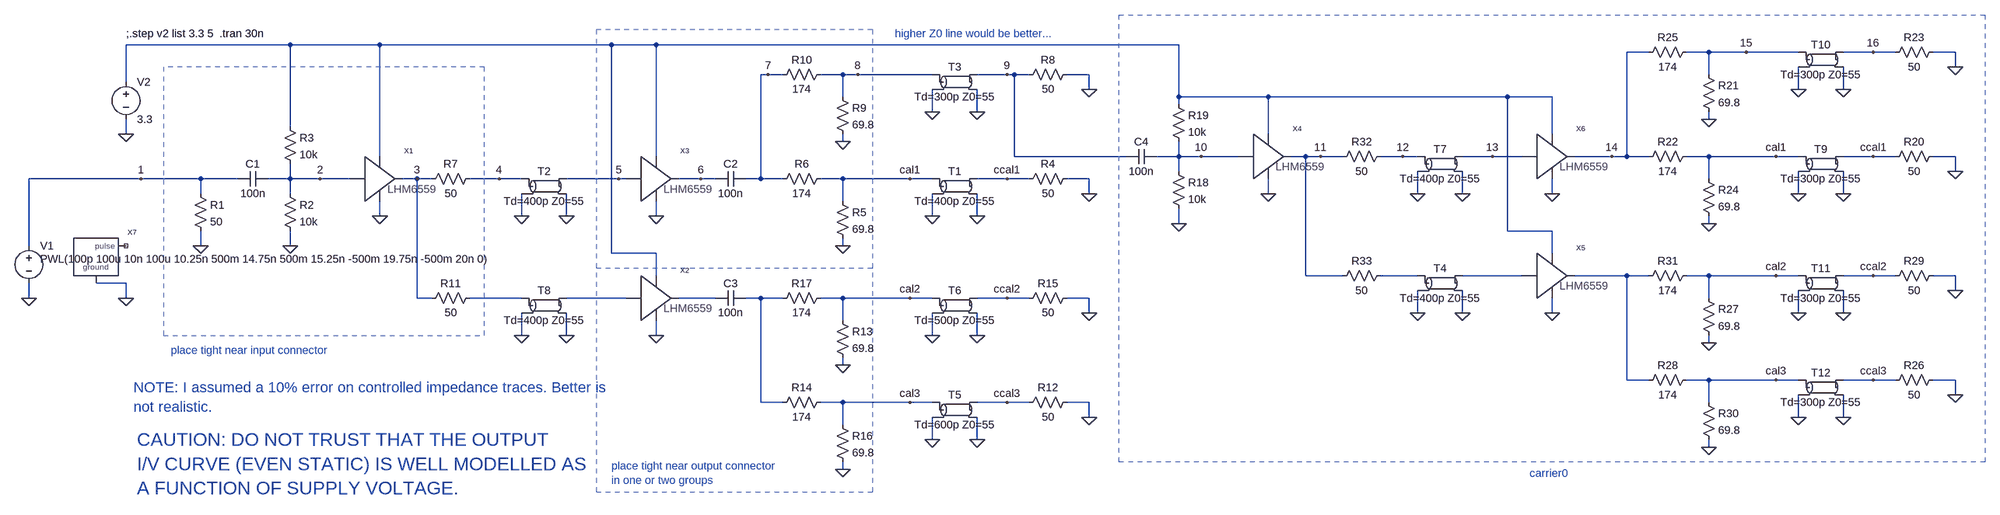
[diagram p0: schematic boardstack_cal.50-Ohms-everywhere.asc]
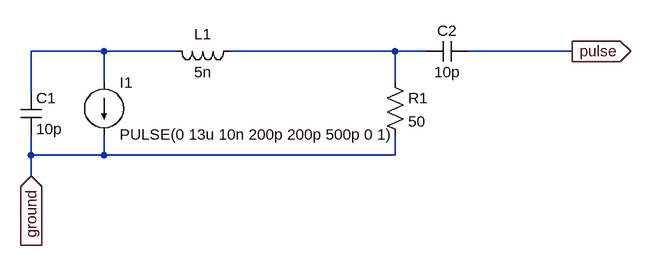
[diagram p1: sub-circuit pulse-generator.gerard.asc]
boardstack_cal.50-Ohms-everywhere.asc, the LTspice schematic file:
Version 4
SHEET 1 4020 908
WIRE 384 -128 32 -128
WIRE 576 -128 384 -128
WIRE 1072 -128 576 -128
WIRE 1168 -128 1072 -128
WIRE 2288 -128 1168 -128
WIRE 3296 -112 3248 -112
WIRE 3424 -112 3376 -112
WIRE 3504 -112 3424 -112
WIRE 3616 -112 3504 -112
WIRE 3776 -112 3712 -112
WIRE 3824 -112 3776 -112
WIRE 3952 -112 3904 -112
WIRE 3952 -80 3952 -112
WIRE 1408 -64 1392 -64
WIRE 1440 -64 1408 -64
WIRE 1568 -64 1520 -64
WIRE 1600 -64 1568 -64
WIRE 1760 -64 1600 -64
WIRE 1920 -64 1856 -64
WIRE 1936 -64 1920 -64
WIRE 1968 -64 1936 -64
WIRE 2096 -64 2048 -64
WIRE 3424 -64 3424 -112
WIRE 32 -48 32 -128
WIRE 2096 -32 2096 -64
WIRE 3616 -32 3616 -80
WIRE 3712 -32 3712 -80
WIRE 1568 -16 1568 -64
WIRE 2288 -16 2288 -128
WIRE 2480 -16 2288 -16
WIRE 2992 -16 2480 -16
WIRE 3088 -16 2992 -16
WIRE 2288 0 2288 -16
WIRE 1760 16 1760 -32
WIRE 1856 16 1856 -32
WIRE 3424 32 3424 16
WIRE 384 48 384 -128
WIRE 32 64 32 32
WIRE 2480 64 2480 -16
WIRE 3088 64 3088 -16
WIRE 1568 80 1568 64
WIRE 576 112 576 -128
WIRE 1168 112 1168 -128
WIRE 1936 112 1936 -64
WIRE 2176 112 1936 112
WIRE 2288 112 2288 80
WIRE 2288 112 2240 112
WIRE 2336 112 2288 112
WIRE 2416 112 2336 112
WIRE 2560 112 2528 112
WIRE 2592 112 2560 112
WIRE 2640 112 2592 112
WIRE 2768 112 2720 112
WIRE 2800 112 2768 112
WIRE 2960 112 2896 112
WIRE 3024 112 2960 112
WIRE 3216 112 3136 112
WIRE 3248 112 3248 -112
WIRE 3248 112 3216 112
WIRE 3296 112 3248 112
WIRE 3424 112 3376 112
WIRE 3568 112 3424 112
WIRE 3616 112 3568 112
WIRE 3776 112 3712 112
WIRE 3824 112 3776 112
WIRE 3952 112 3904 112
WIRE 2288 144 2288 112
WIRE 3952 144 3952 112
WIRE 64 160 -176 160
WIRE 192 160 64 160
WIRE 272 160 192 160
WIRE 384 160 384 128
WIRE 384 160 336 160
WIRE 448 160 384 160
WIRE 512 160 448 160
WIRE 656 160 624 160
WIRE 688 160 656 160
WIRE 832 160 768 160
WIRE 880 160 832 160
WIRE 1088 160 976 160
WIRE 1104 160 1088 160
WIRE 1264 160 1216 160
WIRE 1296 160 1264 160
WIRE 1392 160 1392 -64
WIRE 1392 160 1360 160
WIRE 1440 160 1392 160
WIRE 1568 160 1520 160
WIRE 1712 160 1568 160
WIRE 1760 160 1712 160
WIRE 1920 160 1856 160
WIRE 1968 160 1920 160
WIRE 2096 160 2048 160
WIRE 3424 160 3424 112
WIRE 192 192 192 160
WIRE 384 192 384 160
WIRE 2096 192 2096 160
WIRE 2480 192 2480 160
WIRE 2800 192 2800 144
WIRE 2896 192 2896 144
WIRE 3088 192 3088 160
WIRE 3616 192 3616 144
WIRE 3712 192 3712 144
WIRE 1568 208 1568 160
WIRE 576 240 576 208
WIRE 880 240 880 192
WIRE 976 240 976 192
WIRE 1168 240 1168 208
WIRE 1760 240 1760 192
WIRE 1856 240 1856 192
WIRE 2288 256 2288 224
WIRE 3424 256 3424 240
WIRE 2992 272 2992 -16
WIRE 3088 272 2992 272
WIRE -176 304 -176 160
WIRE 192 304 192 272
WIRE 384 304 384 272
WIRE 1568 304 1568 288
WIRE 1072 320 1072 -128
WIRE 1168 320 1072 320
WIRE 3088 320 3088 272
WIRE 1168 368 1168 320
WIRE 2560 368 2560 112
WIRE 2640 368 2560 368
WIRE 2800 368 2720 368
WIRE 3024 368 2896 368
WIRE 3248 368 3136 368
WIRE 3296 368 3248 368
WIRE 3424 368 3376 368
WIRE 3568 368 3424 368
WIRE 3616 368 3568 368
WIRE 3776 368 3712 368
WIRE 3824 368 3776 368
WIRE 3952 368 3904 368
WIRE 32 384 -32 384
WIRE 3952 400 3952 368
WIRE -176 416 -176 384
WIRE 32 416 32 384
WIRE 656 416 656 160
WIRE 688 416 656 416
WIRE 880 416 768 416
WIRE 1104 416 976 416
WIRE 1296 416 1216 416
WIRE 1392 416 1360 416
WIRE 1440 416 1392 416
WIRE 1568 416 1520 416
WIRE 1712 416 1568 416
WIRE 1760 416 1712 416
WIRE 1920 416 1856 416
WIRE 1968 416 1920 416
WIRE 2096 416 2048 416
WIRE 3424 416 3424 368
WIRE 2096 448 2096 416
WIRE 2800 448 2800 400
WIRE 2896 448 2896 400
WIRE 3088 448 3088 416
WIRE 3616 448 3616 400
WIRE 3712 448 3712 400
WIRE 1568 464 1568 416
WIRE 880 496 880 448
WIRE 976 496 976 448
WIRE 1168 496 1168 464
WIRE 1760 496 1760 448
WIRE 1856 496 1856 448
WIRE 3424 512 3424 496
WIRE 1568 560 1568 544
WIRE 3248 592 3248 368
WIRE 3296 592 3248 592
WIRE 3424 592 3376 592
WIRE 3568 592 3424 592
WIRE 3616 592 3568 592
WIRE 3776 592 3712 592
WIRE 3824 592 3776 592
WIRE 3952 592 3904 592
WIRE 3952 624 3952 592
WIRE 1392 640 1392 416
WIRE 1440 640 1392 640
WIRE 1568 640 1520 640
WIRE 1712 640 1568 640
WIRE 1760 640 1712 640
WIRE 1920 640 1856 640
WIRE 1968 640 1920 640
WIRE 2096 640 2048 640
WIRE 3424 640 3424 592
WIRE 2096 672 2096 640
WIRE 3616 672 3616 624
WIRE 3712 672 3712 624
WIRE 1568 688 1568 640
WIRE 1760 720 1760 672
WIRE 1856 720 1856 672
WIRE 3424 736 3424 720
WIRE 1568 784 1568 768
FLAG 384 304 0
FLAG 192 304 0
FLAG 32 416 0
FLAG 32 64 0
FLAG 576 240 0
FLAG 2096 192 0
FLAG 1168 240 0
FLAG 1920 160 ccal1
FLAG 1760 240 0
FLAG 1856 240 0
FLAG 1568 304 0
FLAG 1712 160 cal1
FLAG 880 240 0
FLAG 976 240 0
FLAG 2096 -32 0
FLAG 1760 16 0
FLAG 1856 16 0
FLAG 1568 80 0
FLAG 1168 496 0
FLAG 880 496 0
FLAG 976 496 0
FLAG 2096 672 0
FLAG 1920 640 ccal3
FLAG 1760 720 0
FLAG 1856 720 0
FLAG 1568 784 0
FLAG 1712 640 cal3
FLAG 2096 448 0
FLAG 1920 416 ccal2
FLAG 1760 496 0
FLAG 1856 496 0
FLAG 1568 560 0
FLAG 1712 416 cal2
FLAG 448 160 2
FLAG 64 160 1
FLAG 656 160 3
FLAG 832 160 4
FLAG 1088 160 5
FLAG 1264 160 6
FLAG 1408 -64 7
FLAG 1600 -64 8
FLAG 1920 -64 9
FLAG 2288 256 0
FLAG 2480 192 0
FLAG 3088 192 0
FLAG 2800 192 0
FLAG 2896 192 0
FLAG 3088 448 0
FLAG 2800 448 0
FLAG 2896 448 0
FLAG 3952 144 0
FLAG 3776 112 ccal1
FLAG 3616 192 0
FLAG 3712 192 0
FLAG 3424 256 0
FLAG 3568 112 cal1
FLAG 3952 -80 0
FLAG 3616 -32 0
FLAG 3712 -32 0
FLAG 3424 32 0
FLAG 3952 624 0
FLAG 3776 592 ccal3
FLAG 3616 672 0
FLAG 3712 672 0
FLAG 3424 736 0
FLAG 3568 592 cal3
FLAG 3952 400 0
FLAG 3776 368 ccal2
FLAG 3616 448 0
FLAG 3712 448 0
FLAG 3424 512 0
FLAG 3568 368 cal2
FLAG 2336 112 10
FLAG 2592 112 11
FLAG 2768 112 12
FLAG 2960 112 13
FLAG 3216 112 14
FLAG 3504 -112 15
FLAG 3776 -112 16
FLAG -176 416 0
SYMBOL voltage -176 288 R0
WINDOW 3 24 44 Left 2
WINDOW 123 0 0 Left 2
WINDOW 39 0 0 Left 2
SYMATTR Value PWL(100p 100u 10n 100u 10.25n 500m 14.75n 500m 15.25n -500m 19.75n -500m 20n 0)
SYMATTR InstName V1
SYMBOL res 176 176 R0
SYMATTR InstName R1
SYMATTR Value 50
SYMBOL res 368 176 R0
SYMATTR InstName R2
SYMATTR Value 10k
SYMBOL res 368 32 R0
SYMATTR InstName R3
SYMATTR Value 10k
SYMBOL cap 336 144 R90
WINDOW 0 0 32 VBottom 2
WINDOW 3 32 32 VTop 2
SYMATTR InstName C1
SYMATTR Value 100n
SYMBOL voltage 32 -64 R0
WINDOW 123 0 0 Left 2
WINDOW 39 0 0 Left 2
SYMATTR InstName V2
SYMATTR Value 3.3
SYMBOL cap 1360 144 R90
WINDOW 0 0 32 VBottom 2
WINDOW 3 32 32 VTop 2
SYMATTR InstName C2
SYMATTR Value 100n
SYMBOL res 2064 144 R90
WINDOW 0 0 56 VBottom 2
WINDOW 3 32 56 VTop 2
SYMATTR InstName R4
SYMATTR Value 50
SYMBOL tline 1808 176 R0
SYMATTR InstName T1
SYMATTR Value Td=400p Z0=55
SYMBOL res 1552 192 R0
SYMATTR InstName R5
SYMATTR Value 69.8
SYMBOL res 1536 144 R90
WINDOW 0 0 56 VBottom 2
WINDOW 3 32 56 VTop 2
SYMATTR InstName R6
SYMATTR Value 174
SYMBOL res 784 144 R90
WINDOW 0 0 56 VBottom 2
WINDOW 3 32 56 VTop 2
SYMATTR InstName R7
SYMATTR Value 50
SYMBOL tline 928 176 R0
SYMATTR InstName T2
SYMATTR Value Td=400p Z0=55
SYMBOL res 2064 -80 R90
WINDOW 0 0 56 VBottom 2
WINDOW 3 32 56 VTop 2
SYMATTR InstName R8
SYMATTR Value 50
SYMBOL tline 1808 -48 R0
SYMATTR InstName T3
SYMATTR Value Td=300p Z0=55
SYMBOL res 1536 -80 R90
WINDOW 0 0 56 VBottom 2
WINDOW 3 32 56 VTop 2
SYMATTR InstName R10
SYMATTR Value 174
SYMBOL cap 1360 400 R90
WINDOW 0 0 32 VBottom 2
WINDOW 3 32 32 VTop 2
SYMATTR InstName C3
SYMATTR Value 100n
SYMBOL res 2064 624 R90
WINDOW 0 0 56 VBottom 2
WINDOW 3 32 56 VTop 2
SYMATTR InstName R12
SYMATTR Value 50
SYMBOL tline 1808 656 R0
SYMATTR InstName T5
SYMATTR Value Td=600p Z0=55
SYMBOL res 1536 624 R90
WINDOW 0 0 56 VBottom 2
WINDOW 3 32 56 VTop 2
SYMATTR InstName R14
SYMATTR Value 174
SYMBOL res 2064 400 R90
WINDOW 0 0 56 VBottom 2
WINDOW 3 32 56 VTop 2
SYMATTR InstName R15
SYMATTR Value 50
SYMBOL tline 1808 432 R0
SYMATTR InstName T6
SYMATTR Value Td=500p Z0=55
SYMBOL res 1536 400 R90
WINDOW 0 0 56 VBottom 2
WINDOW 3 32 56 VTop 2
SYMATTR InstName R17
SYMATTR Value 174
SYMBOL LMH6559 576 160 R0
SYMATTR InstName X1
SYMBOL LMH6559 1168 416 R0
SYMATTR InstName X2
SYMBOL LMH6559 1168 160 R0
SYMATTR InstName X3
SYMBOL res 2272 128 R0
SYMATTR InstName R18
SYMATTR Value 10k
SYMBOL res 2272 -16 R0
SYMATTR InstName R19
SYMATTR Value 10k
SYMBOL LMH6559 2480 112 R0
SYMATTR InstName X4
SYMBOL cap 2240 96 R90
WINDOW 0 0 32 VBottom 2
WINDOW 3 32 32 VTop 2
SYMATTR InstName C4
SYMATTR Value 100n
SYMBOL tline 2848 128 R0
SYMATTR InstName T7
SYMATTR Value Td=400p Z0=55
SYMBOL LMH6559 3088 368 R0
SYMATTR InstName X5
SYMBOL LMH6559 3088 112 R0
SYMATTR InstName X6
SYMBOL res 3920 96 R90
WINDOW 0 0 56 VBottom 2
WINDOW 3 32 56 VTop 2
SYMATTR InstName R20
SYMATTR Value 50
SYMBOL res 3392 96 R90
WINDOW 0 0 56 VBottom 2
WINDOW 3 32 56 VTop 2
SYMATTR InstName R22
SYMATTR Value 174
SYMBOL res 3920 -128 R90
WINDOW 0 0 56 VBottom 2
WINDOW 3 32 56 VTop 2
SYMATTR InstName R23
SYMATTR Value 50
SYMBOL tline 3664 -96 R0
SYMATTR InstName T10
SYMATTR Value Td=300p Z0=55
SYMBOL res 3392 -128 R90
WINDOW 0 0 56 VBottom 2
WINDOW 3 32 56 VTop 2
SYMATTR InstName R25
SYMATTR Value 174
SYMBOL res 3920 576 R90
WINDOW 0 0 56 VBottom 2
WINDOW 3 32 56 VTop 2
SYMATTR InstName R26
SYMATTR Value 50
SYMBOL res 3392 576 R90
WINDOW 0 0 56 VBottom 2
WINDOW 3 32 56 VTop 2
SYMATTR InstName R28
SYMATTR Value 174
SYMBOL res 3920 352 R90
WINDOW 0 0 56 VBottom 2
WINDOW 3 32 56 VTop 2
SYMATTR InstName R29
SYMATTR Value 50
SYMBOL res 3392 352 R90
WINDOW 0 0 56 VBottom 2
WINDOW 3 32 56 VTop 2
SYMATTR InstName R31
SYMATTR Value 174
SYMBOL res 2736 96 R90
WINDOW 0 0 56 VBottom 2
WINDOW 3 32 56 VTop 2
SYMATTR InstName R32
SYMATTR Value 50
SYMBOL tline 3664 128 R0
SYMATTR InstName T9
SYMATTR Value Td=300p Z0=55
SYMBOL tline 3664 384 R0
SYMATTR InstName T11
SYMATTR Value Td=300p Z0=55
SYMBOL tline 3664 608 R0
SYMATTR InstName T12
SYMATTR Value Td=300p Z0=55
SYMBOL res 1552 -32 R0
SYMATTR InstName R9
SYMATTR Value 69.8
SYMBOL res 1552 448 R0
SYMATTR InstName R13
SYMATTR Value 69.8
SYMBOL res 1552 672 R0
SYMATTR InstName R16
SYMATTR Value 69.8
SYMBOL res 3408 -80 R0
SYMATTR InstName R21
SYMATTR Value 69.8
SYMBOL res 3408 144 R0
SYMATTR InstName R24
SYMATTR Value 69.8
SYMBOL res 3408 400 R0
SYMATTR InstName R27
SYMATTR Value 69.8
SYMBOL res 3408 624 R0
SYMATTR InstName R30
SYMATTR Value 69.8
SYMBOL tline 2848 384 R0
SYMATTR InstName T4
SYMATTR Value Td=400p Z0=55
SYMBOL tline 928 432 R0
SYMATTR InstName T8
SYMATTR Value Td=400p Z0=55
SYMBOL res 784 400 R90
WINDOW 0 0 56 VBottom 2
WINDOW 3 32 56 VTop 2
SYMATTR InstName R11
SYMATTR Value 50
SYMBOL res 2736 352 R90
WINDOW 0 0 56 VBottom 2
WINDOW 3 32 56 VTop 2
SYMATTR InstName R33
SYMATTR Value 50
SYMBOL pulse-generator.gerard -32 320 R0
SYMATTR InstName X7
TEXT 232 -152 Left 2 !.tran 30n
TEXT 32 -152 Left 2 !;.step v2 list 3.3 5
TEXT 56 720 Left 4 ;CAUTION: DO NOT TRUST THAT THE OUTPUT\nI/V CURVE (EVEN STATIC) IS WELL MODELLED AS\nA FUNCTION OF SUPPLY VOLTAGE.
TEXT 128 528 Left 2 ;place tight near input connector
TEXT 1072 776 Left 2 ;place tight near output connector\nin one or two groups
TEXT 1680 -152 Left 2 ;higher Z0 line would be better...
TEXT 48 608 Left 3 ;NOTE: I assumed a 10% error on controlled impedance traces. Better is\nnot realistic.
TEXT 3040 792 Left 2 ;carrier0
LINE Normal 1632 352 1040 352 2
RECTANGLE Normal 112 496 800 -80 2
RECTANGLE Normal 1040 832 1632 -160 2
RECTANGLE Normal 4016 768 2160 -192 2

pulse-generator.gerard.asc, the sub-circuit schematic file:
Version 4
SHEET 1 880 680
WIRE -80 208 -192 208
WIRE 32 208 -80 208
WIRE 368 208 112 208
WIRE 416 208 368 208
WIRE 640 208 480 208
WIRE -80 256 -80 208
WIRE 368 256 368 208
WIRE -192 272 -192 208
WIRE -192 368 -192 336
WIRE -80 368 -80 336
WIRE -80 368 -192 368
WIRE 368 368 368 336
WIRE 368 368 -80 368
WIRE -192 400 -192 368
FLAG -192 400 ground
IOPIN -192 400 In
FLAG 640 208 pulse
IOPIN 640 208 Out
SYMBOL ind 128 192 R90
WINDOW 0 5 56 VBottom 2
WINDOW 3 32 56 VTop 2
SYMATTR InstName L1
SYMATTR Value 5n
SYMBOL cap -208 272 R0
SYMATTR InstName C1
SYMATTR Value 10p
SYMBOL res 352 240 R0
SYMATTR InstName R1
SYMATTR Value 50
SYMBOL current -80 256 R0
WINDOW 123 0 0 Left 2
WINDOW 39 0 0 Left 2
SYMATTR InstName I1
SYMATTR Value PULSE(0 13u 10n 200p 200p 500p 0 1)
SYMBOL cap 480 192 R90
WINDOW 0 0 32 VBottom 2
WINDOW 3 32 32 VTop 2
SYMATTR InstName C2
SYMATTR Value 10p

The netlist it stands for:
* boardstack_cal.50-Ohms-everywhere.asc
V1 1 0 PWL(100p 100u 10n 100u 10.25n 500m 14.75n 500m 15.25n -500m 19.75n -500m 20n 0)
R1 1 0 50
R2 2 0 10k
R3 N001 2 10k
C1 2 1 100n
V2 N001 0 3.3
C2 7 6 100n
R4 0 ccal1 50
T1 cal1 0 ccal1 0 Td=400p Z0=55
R5 cal1 0 69.8
R6 cal1 7 174
R7 4 3 50
T2 4 0 5 0 Td=400p Z0=55
R8 0 9 50
T3 8 0 9 0 Td=300p Z0=55
R10 8 7 174
C3 N008 N007 100n
R12 0 ccal3 50
T5 cal3 0 ccal3 0 Td=600p Z0=55
R14 cal3 N008 174
R15 0 ccal2 50
T6 cal2 0 ccal2 0 Td=500p Z0=55
R17 cal2 N008 174
XX1 2 N001 0 3 LMH6559  ; pins IN V+ V- OUT
XX2 N006 N001 0 N007 LMH6559  ; pins IN V+ V- OUT
XX3 5 N001 0 6 LMH6559  ; pins IN V+ V- OUT
R18 10 0 10k
R19 N001 10 10k
XX4 10 N001 0 11 LMH6559  ; pins IN V+ V- OUT
C4 10 9 100n
T7 12 0 13 0 Td=400p Z0=55
XX5 N003 N001 0 N004 LMH6559  ; pins IN V+ V- OUT
XX6 13 N001 0 14 LMH6559  ; pins IN V+ V- OUT
R20 0 ccal1 50
R22 cal1 14 174
R23 0 16 50
T10 15 0 16 0 Td=300p Z0=55
R25 15 14 174
R26 0 ccal3 50
R28 cal3 N004 174
R29 0 ccal2 50
R31 cal2 N004 174
R32 12 11 50
T9 cal1 0 ccal1 0 Td=300p Z0=55
T11 cal2 0 ccal2 0 Td=300p Z0=55
T12 cal3 0 ccal3 0 Td=300p Z0=55
R9 8 0 69.8
R13 cal2 0 69.8
R16 cal3 0 69.8
R21 15 0 69.8
R24 cal1 0 69.8
R27 cal2 0 69.8
R30 cal3 0 69.8
T4 N002 0 N003 0 Td=400p Z0=55
T8 N005 0 N006 0 Td=400p Z0=55
R11 N005 3 50
R33 N002 11 50
XX7 NC_01 0 pulse-generator.gerard

* block symbol definitions
.subckt pulse-generator.gerard pulse ground
L1 N002 N001 5n
C1 N001 ground 10p
R1 N002 ground 50
I1 N001 ground PULSE(0 13u 10n 200p 200p 500p 0 1)
C2 pulse N002 10p
.ends pulse-generator.gerard

.tran 30n
;.step v2 list 3.3 5
* CAUTION: DO NOT TRUST THAT THE OUTPUT
* I/V CURVE (EVEN STATIC) IS WELL MODELLED AS
* A FUNCTION OF SUPPLY VOLTAGE.
* place tight near input connector
* place tight near output connector
* in one or two groups
* higher Z0 line would be better...
* NOTE: I assumed a 10% error on controlled impedance traces. Better is
* not realistic.
* carrier0
.lib LMH6559.MOD
.backanno
.end